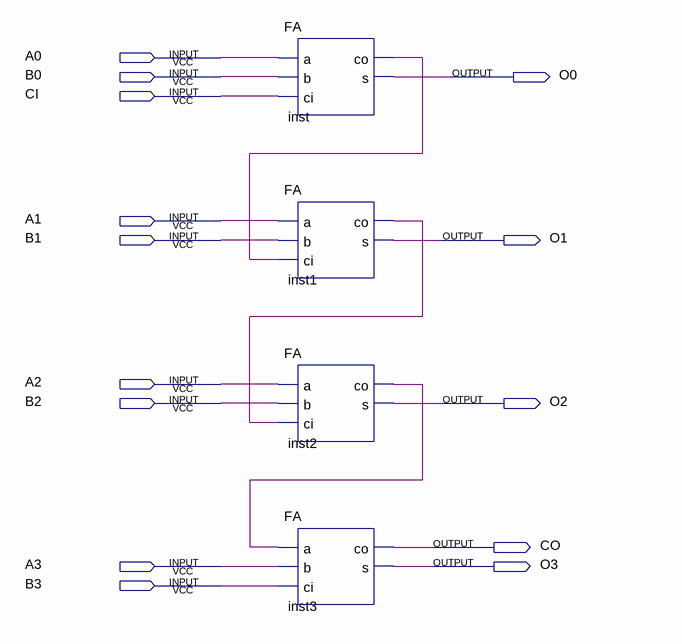
[diagram p0: schematic sheet]
// Quartus schematic lab3b.bdf as structural Verilog: 4 symbols, 14 pins
module lab3b (
  input  A0,
  input  B0,
  input  CI,
  input  A1,
  input  B1,
  input  A2,
  input  B2,
  input  A3,
  input  B3,
  output O0,
  output O1,
  output O2,
  output CO,
  output O3
);

  wire inst1_co, inst2_co, inst_co;

  FA inst (.a(A0), .b(B0), .ci(CI), .co(inst_co), .s(O0));
  FA inst1 (.a(A1), .b(B1), .ci(inst_co), .co(inst1_co), .s(O1));
  FA inst2 (.a(A2), .b(B2), .ci(inst1_co), .co(inst2_co), .s(O2));
  FA inst3 (.a(inst2_co), .b(A3), .ci(B3), .co(CO), .s(O3));
endmodule
